# EAGLE design gocupi_v1.1 (EAGLE 6.4)
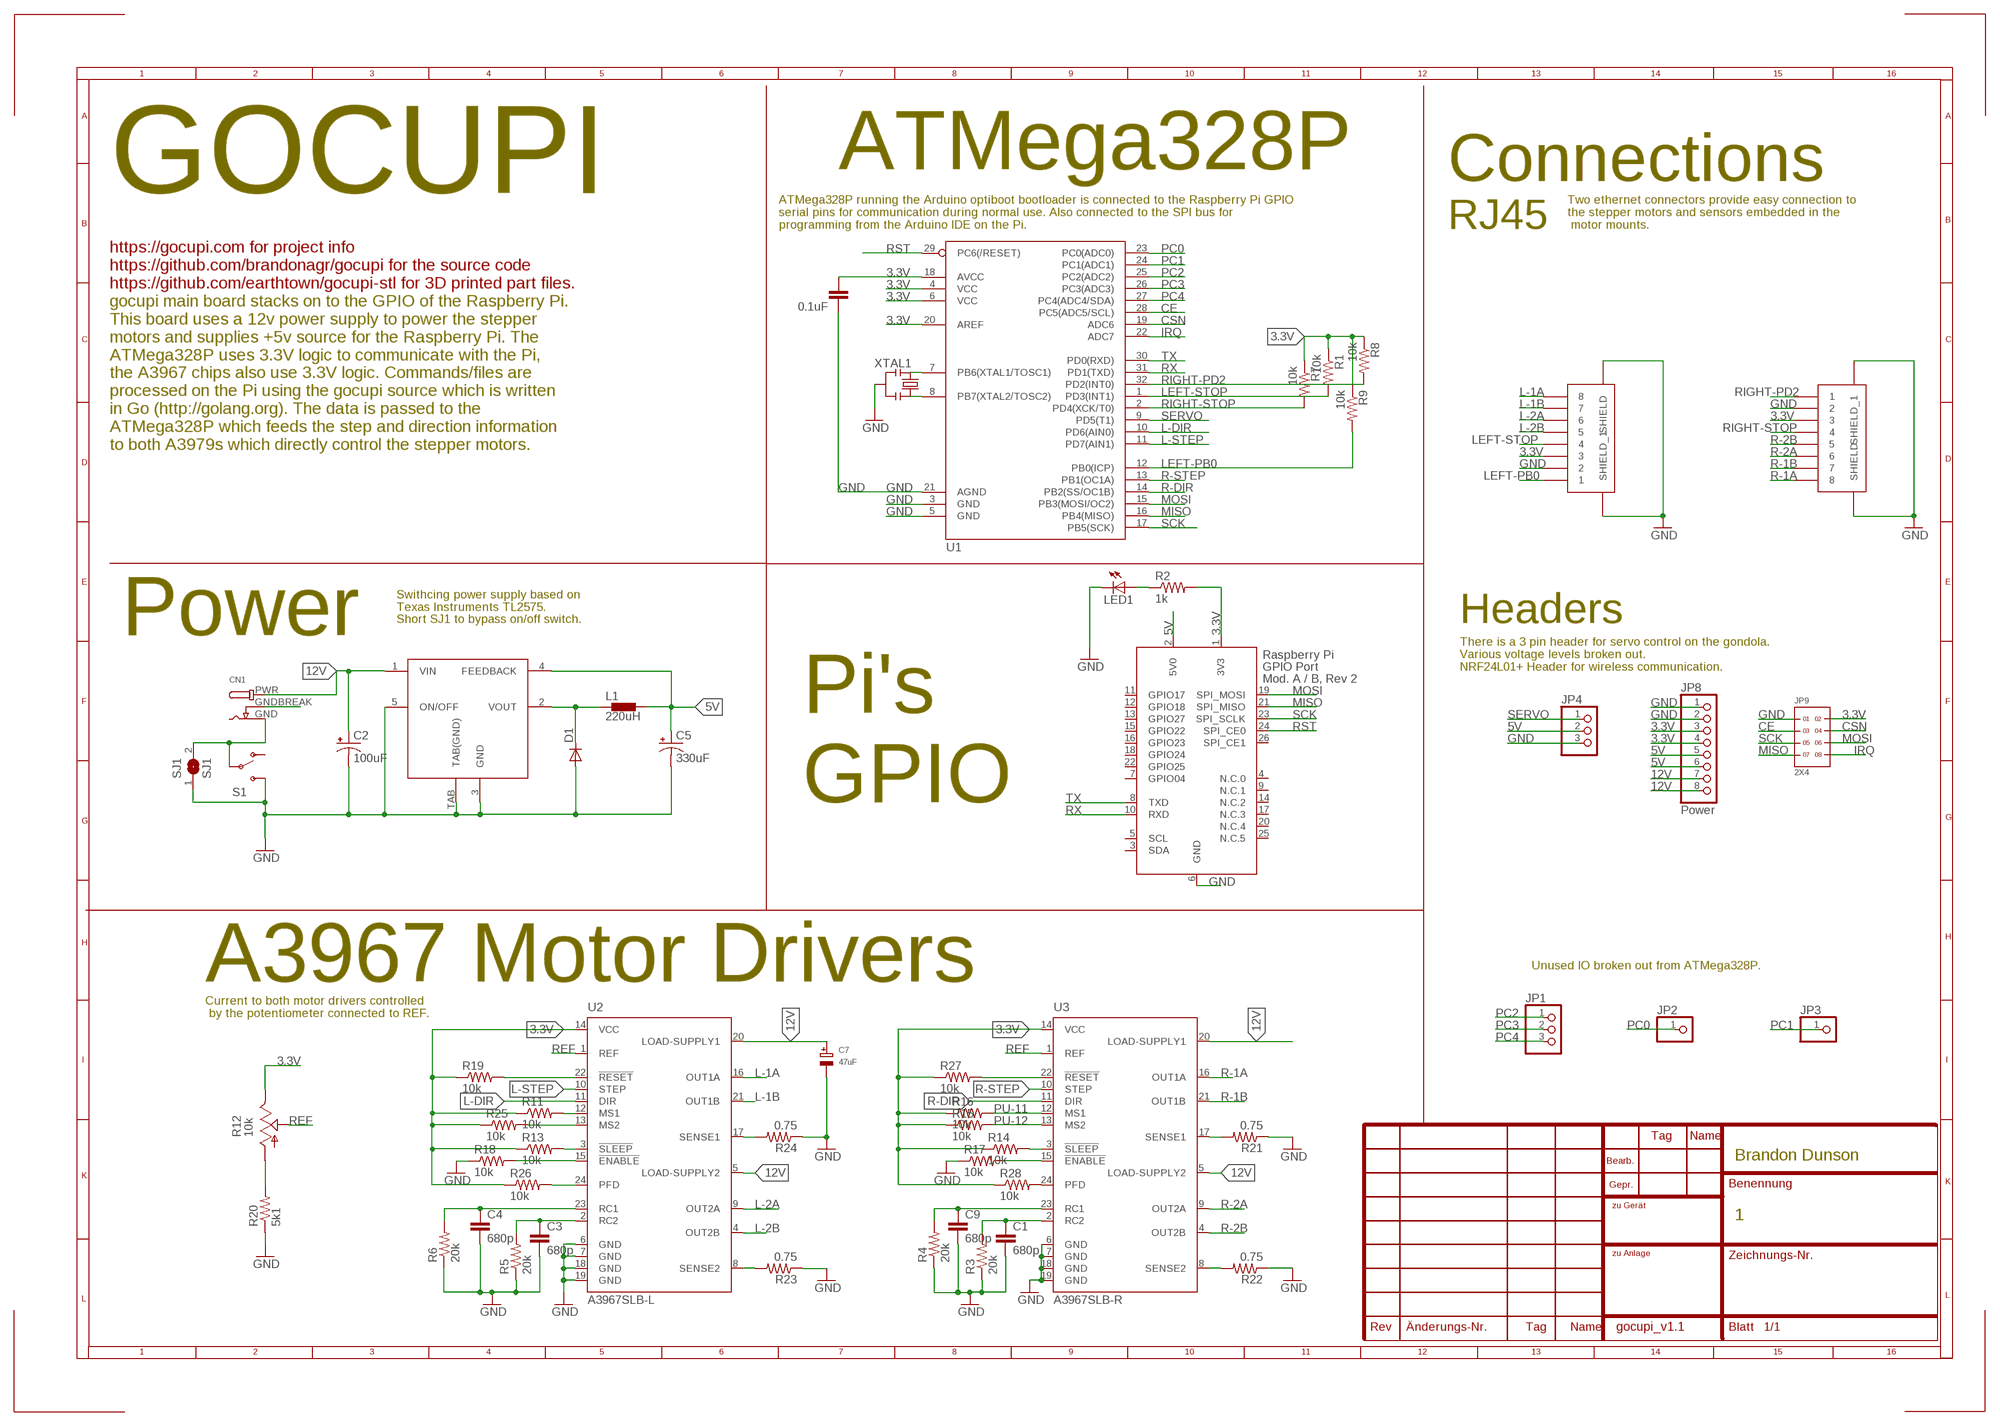
[diagram p0: schematic, sheet 1]

## Parts
C1  680p  CAP0805  [0805]
C2  100uF  CPOL-USD  [PANASONIC_D]
C3  680p  CAP0805  [0805]
C4  680p  CAP0805  [0805]
C5  330uF  CPOL-USF  [PANASONIC_F]
C7  47uF  CAP_ELECTROLYTICPANASONIC_C  [PANASONIC_C]
C8  0.1uF  CAP0805  [0805]
C9  680p  CAP0805  [0805]
CN1  DCBARRELSMT_CORRECT  [DCJACK_2MM_SMT]
D1  DIODE-SOD-123  [SOD-123]
JP1  PINHD-1X3CB  [1X03-CLEANBIG]
JP2  PINHD-1X1CB  [1X01-CLEANBIG]
JP3  PINHD-1X1CB  [1X01-CLEANBIG]
JP4  PINHD-1X3  [1X03]
JP8  Power  PINHD-1X8CLEANBIG  [1X08-CLEANBIG]
JP9  2X4  [2X4]
L1  220uH  SDR1305  [SDR1305]
LED1  LEDCHIPLED_0805  [CHIPLED_0805]
R1  10k  RESISTOR0805-RES  [0805]
R2  1k  RESISTOR0805-RES  [0805]
R3  20k  RESISTOR0805-RES  [0805]
R4  20k  RESISTOR0805-RES  [0805]
R5  20k  RESISTOR0805-RES  [0805]
R6  20k  RESISTOR0805-RES  [0805]
R7  10k  RESISTOR0805-RES  [0805]
R8  10k  RESISTOR0805-RES  [0805]
R9  10k  RESISTOR0805-RES  [0805]
R11  10k  RESISTOR0805-RES  [0805]
R12  10k  TRIM_US-SM-42/43A  [SM-42/43A]
R13  10k  RESISTOR0805-RES  [0805]
R14  10k  RESISTOR0805-RES  [0805]
R15  10k  RESISTOR0805-RES  [0805]
R16  10k  RESISTOR0805-RES  [0805]
R17  10k  RESISTOR0805-RES  [0805]
R18  10k  RESISTOR0805-RES  [0805]
R19  10k  RESISTOR0805-RES  [0805]
R20  5k1  RESISTOR0805-RES  [0805]
R21  0.75  RESISTOR0805-RES  [0805]
R22  0.75  RESISTOR0805-RES  [0805]
R23  0.75  RESISTOR0805-RES  [0805]
R24  0.75  RESISTOR0805-RES  [0805]
R25  10k  RESISTOR0805-RES  [0805]
R26  10k  RESISTOR0805-RES  [0805]
R27  10k  RESISTOR0805-RES  [0805]
R28  10k  RESISTOR0805-RES  [0805]
RJ45-L  RJ45_SMD  [RJ45_SMD]
RJ45-R  RJ45_SMD  [RJ45_SMD]
S1  SWITCH-SPST-SMD-A  [SWITCH-SPST-SMD-A]
SJ1  SJ1  SJ  [SJ]
U1  ATMEGA328_SMT  [TQFP32-08]
U2  A3967SLB-L  A3967SLB  [SO24W]
U3  A3967SLB-R  A3967SLB  [SO24W]
U4  TL2575  [TO263_5]
X1  RASPI_BOARD_AB_E2P  [RASPI_BOARD_AB_EDGES_2DRILL_PAD]
XTAL1  10MHz  RESONATORSMD  [RESONATOR-SMD]

## Nets
3.3V: C8.1 JP8.3 JP8.4 JP9.2 R1.1 R2.2 R7.1 R8.1 R9.1 R11.1 R12.3(E) R13.1 R14.1 R15.1 R16.1 R19.1 R25.1 R26.1 R27.1 R28.1 RJ45-L.P$3 RJ45-R.P$3 U1.4(VCC) U1.6(VCC) U1.18(AVCC) U1.20(AREF) U2.14(VCC) U3.14(VCC) X1.1(3V3)
5V: C5.+ JP4.2 JP8.5 JP8.6 L1.P$2 U4.4(FEEDBACK) X1.2(5V0)
12V: C2.+ C7.+ CN1.PWR JP8.7 JP8.8 U2.5(LOAD-SUPPLY2) U2.20(LOAD-SUPPLY1) U3.5(LOAD-SUPPLY2) U3.20(LOAD-SUPPLY1) U4.1(VIN)
B-GND: CN1.GNDBREAK
CE: JP9.3 U1.28(PC5(ADC5/SCL))
CSN: JP9.4 U1.19(ADC6)
GND: C1.2 C2.- C3.2 C4.2 C5.- C7.- C8.2 C9.2 D1.A JP4.3 JP8.1 JP8.2 JP9.1 LED1.C R3.1 R4.1 R5.1 R6.1 R17.1 R18.1 R20.1 R21.1 R22.1 R23.1 R24.1 RJ45-L.P$2 RJ45-L.P$SHIELD(SHIELD) RJ45-L.P$SHIELD_1(SHIELD_1) RJ45-R.P$2 RJ45-R.P$SHIELD(SHIELD) RJ45-R.P$SHIELD_1(SHIELD_1) S1.3(S) SJ1.1 U1.3(GND) U1.5(GND) U1.21(AGND) U2.6(GND) U2.7(GND) U2.18(GND) U2.19(GND) U3.6(GND) U3.7(GND) U3.18(GND) U3.19(GND) U4.3(GND) U4.5(ON/OFF) U4.TAB(TAB(GND)) X1.6(GND) XTAL1.2
IRQ: JP9.8 U1.22(ADC7)
L-1A: RJ45-L.P$8 U2.16(OUT1A)
L-1B: RJ45-L.P$7 U2.21(OUT1B)
L-2A: RJ45-L.P$6 U2.9(OUT2A)
L-2B: RJ45-L.P$5 U2.4(OUT2B)
L-DIR: U1.10(PD6(AIN0)) U2.11(DIR)
L-STEP: U1.11(PD7(AIN1)) U2.10(STEP)
LEFT-PB0: R9.2 RJ45-L.P$1 U1.12(PB0(ICP))
LEFT-STOP: R1.2 RJ45-L.P$4 U1.1(PD3(INT1))
MISO: JP9.7 U1.16(PB4(MISO)) X1.21(SPI_MISO)
MOSI: JP9.6 U1.15(PB3(MOSI/OC2)) X1.19(SPI_MOSI)
N$1: D1.C L1.P$1 U4.2(VOUT)
N$2: CN1.GND S1.2(P) SJ1.2
N$3: LED1.A R2.1
N$7: R28.2 U3.24(PFD)
N$8: R19.2 U2.22(!RESET)
N$9: R11.2 U2.12(MS1)
N$12: R26.2 U2.24(PFD)
N$15: R27.2 U3.22(!RESET)
N$16: R25.2 U2.13(MS2)
N$17: R17.2 U3.15(!ENABLE)
N$18: R14.2 U3.3(!SLEEP)
N$19: R13.2 U2.3(!SLEEP)
N$21: R12.1(A) R20.2
N$26: R18.2 U2.15(!ENABLE)
N$28: C4.1 R6.2 U2.23(RC1)
N$29: C3.1 R5.2 U2.2(RC2)
N$30: R24.2 U2.17(SENSE1)
N$31: R21.2 U3.17(SENSE1)
N$32: R23.2 U2.8(SENSE2)
N$33: C9.1 R4.2 U3.23(RC1)
N$34: R22.2 U3.8(SENSE2)
N$35: C1.1 R3.2 U3.2(RC2)
N$39: U1.7(PB6(XTAL1/TOSC1)) XTAL1.1
N$40: U1.8(PB7(XTAL2/TOSC2)) XTAL1.3
PC0: JP2.1 U1.23(PC0(ADC0))
PC1: JP3.1 U1.24(PC1(ADC1))
PC2: JP1.1 U1.25(PC2(ADC2))
PC3: JP1.2 U1.26(PC3(ADC3))
PC4: JP1.3 U1.27(PC4(ADC4/SDA))
PU-11: R16.2 U3.12(MS1)
PU-12: R15.2 U3.13(MS2)
R-1A: RJ45-R.P$8 U3.16(OUT1A)
R-1B: RJ45-R.P$7 U3.21(OUT1B)
R-2A: RJ45-R.P$6 U3.9(OUT2A)
R-2B: RJ45-R.P$5 U3.4(OUT2B)
R-DIR: U1.14(PB2(SS/OC1B)) U3.11(DIR)
R-STEP: U1.13(PB1(OC1A)) U3.10(STEP)
REF: R12.2(S) U2.1(REF) U3.1(REF)
RIGHT-PD2: R8.2 RJ45-R.P$1 U1.32(PD2(INT0))
RIGHT-STOP: R7.2 RJ45-R.P$4 U1.2(PD4(XCK/T0))
RST: U1.29(PC6(/RESET)) X1.24(SPI_CE0)
RX: U1.31(PD1(TXD)) X1.10(RXD)
SCK: JP9.5 U1.17(PB5(SCK)) X1.23(SPI_SCLK)
SERVO: JP4.1 U1.9(PD5(T1))
TX: U1.30(PD0(RXD)) X1.8(TXD)
Unconnected: S1.1(O) X1.3(SDA) X1.4(N.C.0) X1.5(SCL) X1.7(GPIO04) X1.9(N.C.1) X1.11(GPIO17) X1.12(GPIO18) X1.13(GPIO27) X1.14(N.C.2) X1.15(GPIO22) X1.16(GPIO23) X1.17(N.C.3) X1.18(GPIO24) X1.20(N.C.4) X1.22(GPIO25) X1.25(N.C.5) X1.26(SPI_CE1)

## Notes on the sheet
- ATMega328P | Connections
- GOCUPI
- ATMega328P running the Arduino optiboot bootloader is connected to the Raspberry Pi GPIO 
  serial pins for communication during normal use. Also connected to the SPI bus for 
  programming from the Arduino IDE on the Pi.
- RJ45
- Two ethernet connectors provide easy connection to
  the stepper motors and sensors embedded in the
   motor mounts.
- gocupi main board stacks on to the GPIO of the Raspberry Pi. 
  This board uses a 12v power supply to power the stepper 
  motors and supplies +5v source for the Raspberry Pi. The
  ATMega328P uses 3.3V logic to communicate with the Pi, 
  the A3967 chips also use 3.3V logic. Commands/files are 
  processed on the Pi using the gocupi source which is written 
  in Go (http://golang.org). The data is passed to the 
  ATMega328P which feeds the step and direction information
  to both A3979s which directly control the stepper motors.
- https://gocupi.com for project info
  https://github.com/brandonagr/gocupi for the source code
  https://github.com/earthtown/gocupi-stl for 3D printed part files.
- Swithcing power supply based on 
  Texas Instruments TL2575.
- Short SJ1 to bypass on/off switch. | Headers
- Power
- There is a 3 pin header for servo control on the gondola.
  Various voltage levels broken out.
  NRF24L01+ Header for wireless communication.
- Pi's
  GPIO
- Unused IO broken out from ATMega328P.
- A3967 Motor Drivers
- Current to both motor drivers controlled
   by the potentiometer connected to REF.
- Brandon Dunson
- 1

## Library data of the parts
C1 C3 C4 C8 C9 = SparkFun-Passives:CAP: Capacitor Standard 0603 ceramic capacitor, and 0.1" leaded capacitor.
C2 C5 = adafruit:CPOL-US: POLARIZED CAPACITOR, American symbol
C7 = microbuilder:CAP_ELECTROLYTIC: Electrolytic Capacitors SMT PANASONIC_C - Size C Panasonic Electrolytic Aluminum Capacitor 47µF 16V 20% Electrolytic Capacitor [Digikey: PCE3890TR-ND] PANASONIC_D - Size D Panasonic Electrolytic Aluminum Capacitor 100µF 25V 20% Electrolytic Capacitor [Digikey: PCE3898TR-ND] PTH 3.5 mm grid, 8 mm diameter ... 3.5 mm grid, 10 mm diameter ...
CN1 = microbuilder:DCBARREL: DC Barrel Jack DCJACK_1.3MM_PTH - Through Hole 1.3mm Jack (4UConnector: 05536) DCJACK_2MM_PTH - Through Hole 2.0/2.1 Jack (4UConnector: 05537) DCJACK_2MM_SMT - SMT 2.0/2.1mm Jack(4UConnector: 03267)
D1 = dp_devices:DIODE: Various Diode Packages
JP1 JP4 = adafruit:PINHD-1X3: PIN HEADER
JP2 JP3 = adafruit:PINHD-1X1: Pin header 1x1 for 0.1" spacing With round pins
JP8 = adafruit:PINHD-1X8: PIN HEADER
JP9 = headers(.1in):2X4
L1 = inductors:SDR1305
LED1 = adafruit:LED: LED OSRAM: - CHIPLED LG R971, LG N971, LY N971, LG Q971, LY Q971, LO R971, LY R971 LH N974, LH R974 LS Q976, LO Q976, LY Q976 LO Q996 - Hyper CHIPLED LW Q18S LB Q993, LB Q99A, LB R99A - SideLED LS A670, LO A670, LY A670, LG A670, LP A670 LB A673, LV A673, LT A673, LW A673 LH A674 LY A675 LS A676, LA A676, LO A676, LY A676, LW A676 LS A679, LY A679, LG A679 - Hyper Micro SIDELED® LS Y876, LA Y876, LO Y876, LY Y876 LT Y87S - SmartLED LW L88C, LW L88S LB L89C, LB L89S, LG L890 LS L89K, LO L89K, LY L89K LS L896, LA L896, LO L896, LY L896 - TOPLED LS T670, LO T670, LY T670, LG T670, LP T670 LSG T670, LSP T670, LSY T670, LOP T670, LYG T670 LG T671, LOG T671, LSG T671 LB T673, LV T673, LT T673, LW T673 LH T674 LS T676, LA T676, LO T676, LY T676, LB T676, LH T676, LSB T676, LW T676 LB T67C, LV T67C, LT T67C, LS T67K, LO T67K, LY T67K, LW E67C LS E67B, LA E67B, LO E67B, LY E67B, LB E67C, LV E67C, LT E67C LW T67C LS T679, LY T679, LG T679 LS T770, LO T770, LY T770, LG T770, LP T770 LB T773, LV T773, LT T773, LW T773 LH T774 LS E675, LA E675, LY E675, LS T675 LS T776, LA T776, LO T776, LY T776, LB T776 LHGB T686 LT T68C, LB T68C - Hyper Mini TOPLED® LB M676 - Mini TOPLED Santana® LG M470 LS M47K, LO M47K, LY M47K Source: http://www.osram.convergy.de/
R1-R9 R11 R13-R24 R26-R28 = SparkFun-Resistors:RESISTOR: Resistor Basic schematic elements and footprints for 0603, 1206, and PTH resistors.
R12 = pot:TRIM_US-: POTENTIOMETER
R25 = SparkFun-Passives:RESISTOR: Resistor Basic schematic elements and footprints for 0603, 1206, and PTH resistors.
RJ45-L RJ45-R = rj45_smd:RJ45_SMD
S1 = SwK-SparkFun:SWITCH-SPST: SPST Switch Simple slide switch. Spark Fun Electronics SKU : COM-00102
SJ1 = jumper:SJ: SMD solder JUMPER
U1 = SparkFun-DigitalIC:ATMEGA328_SMT: 32-Pin Atmega328 part Commonly used on Arduino compatible boards Available in QFP and QFN packages TQFP is IC-09069 QFN is non-stock; PROD_ID: IC-09069; VALUE: ATMEGA328P
U2 U3 = allegro:A3967SLB: MICROSTEPPING DRIVER WITH TRANSLATOR Source: 3967.pdf; MF: ALLEGRO MICROSYSTEMS, INC.; MPN: A3967SLB-T; OC_FARNELL: 1521715; OC_NEWARK: 08J5877
U4 = TL2575_new:TL2575
X1 = raspberrypi_bastelstube_v13:RASPI_BOARD_AB: Raspberry Pi GPIO connector with markings for the outer dimensions of the Raspberry Pi board model A or B with different sets of drill holes or mounting pads for model B Revision 2.0
XTAL1 = SwK-SparkFun:RESONATOR: Resonator Small SMD resonator. This is the itty bitty 10/20MHz resonators with built in caps. CSTCE10M0G55 and CSTCE20M0V53. Footprint has been reviewed closely but hasn't been tested yet.

## Board
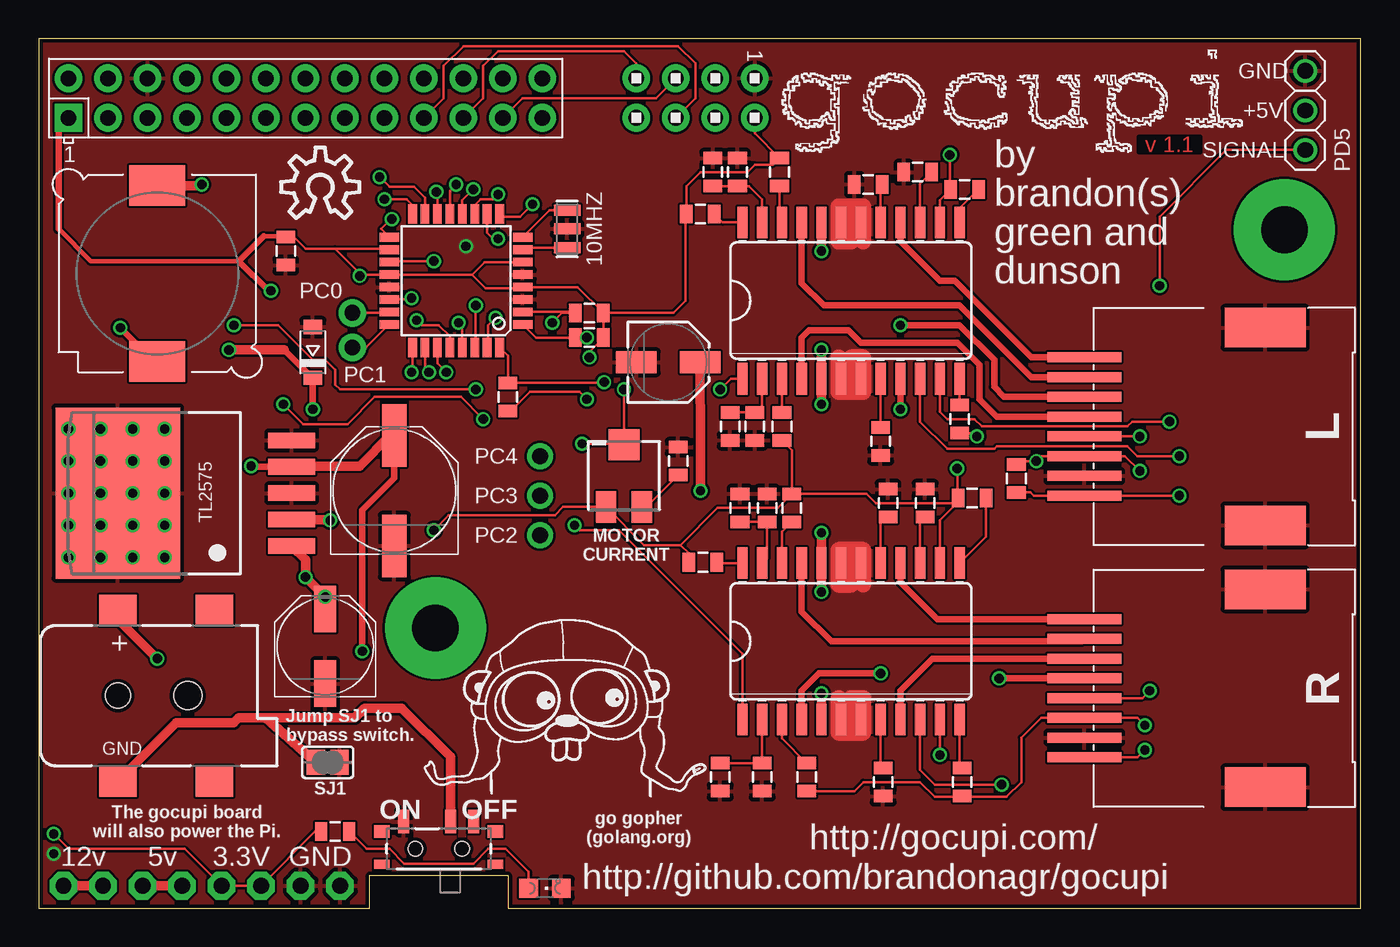
[diagram p1: board, top side]
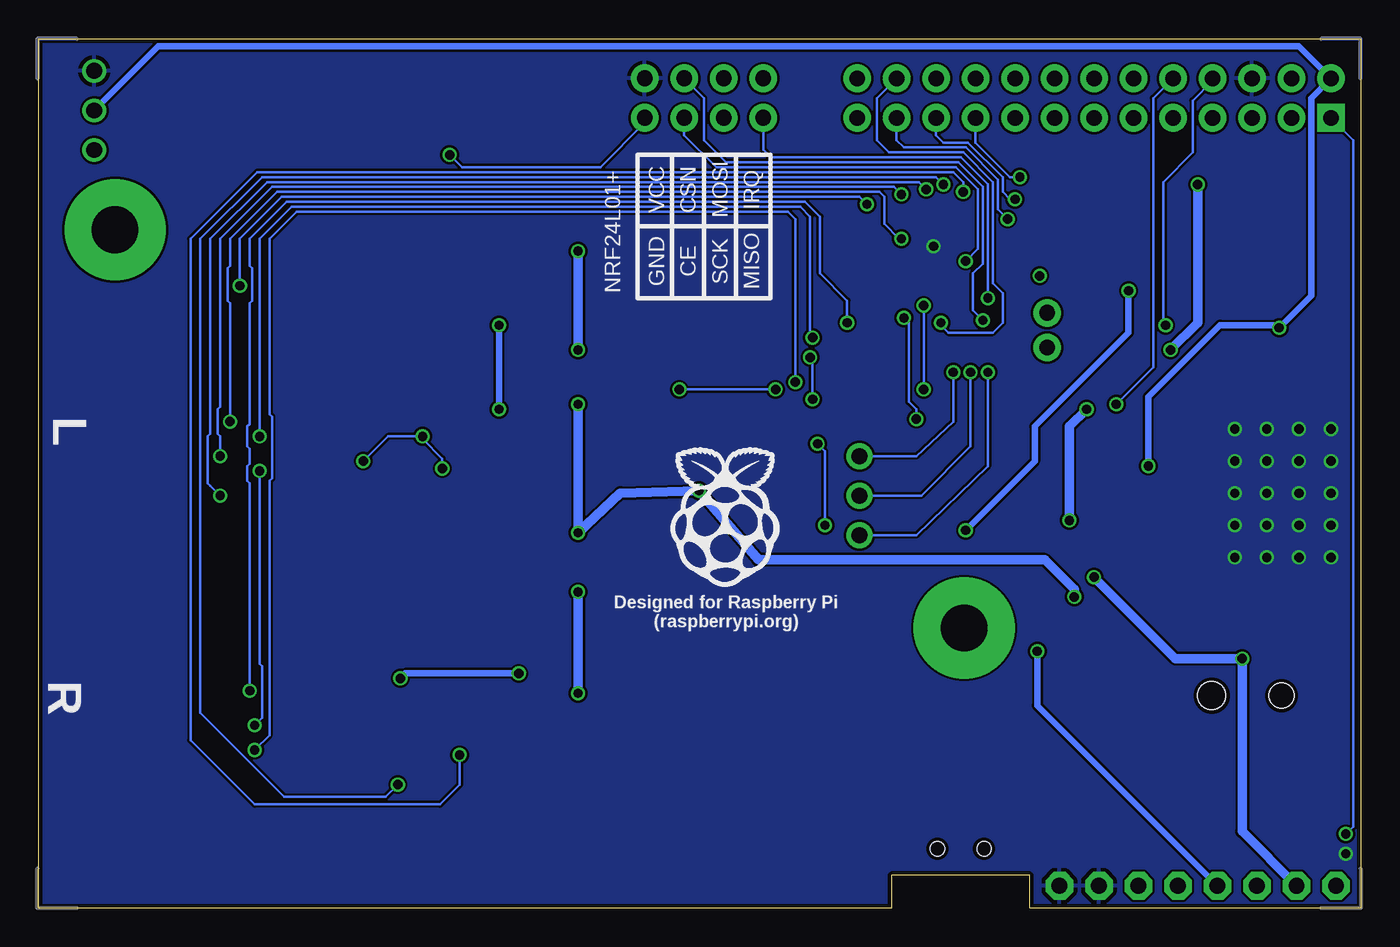
[diagram p2: board, bottom side, seen from below]

Size 85 x 55.87 mm. Coordinates in mm from the lower left corner, seen from the top.
Outline: 0,0 21.27,0 21.27,2.1 30.16,2.1 30.16,0 85,0 85,55.87 0,55.87 0,0
Copper layers (1*2*15*16): Top 0.035mm / dielectric 0.2mm / Route2 0.0175mm / dielectric 1.1mm / Route15 0.0175mm / dielectric 0.2mm / Bottom 0.035mm
Design rules "SeeedStudio_DRU_no_angle_20130527": minimum track width 6mil, minimum drill 12mil, track to track 6mil, track to pad 6mil, pad to pad 6mil, via to via 6mil, smd to smd 0mil, copper to edge 10mil, drill to drill 10mil, minimum pad ring 6mil, minimum via ring 6mil, stop-mask expansion 2mil, vias tented up to drill 25mil, thermal gap 10mil

### Footprints (pad centres in the part's own frame; a part is rotated, then mirrored left to right if it is on the bottom)
0805 = smd 0.8 x 1.2: 1 -0.9,0; 2 0.9,0
PANASONIC_D = smd 3 x 1.4: + 2.4,0; - -2.4,0
PANASONIC_F = smd 4 x 1.6: + 3.55,0; - -3.55,0
PANASONIC_C = smd 2.6 x 1.4: + 2.05,0; - -2.05,0
DCJACK_2MM_SMT = smd 2.4 x 2: GND 0,-5.5; GNDBREAK 6.2,-5.5; PWR 0,5.5; PWR2 6.2,5.5 | hole 1.6: 0,0 | hole 1.8: 4.5,0
SOD-123 = smd 0.91 x 1.22: A 1.635,0; C -1.635,0
1X03-CLEANBIG = drill 1.016 pad 1.676: 1 -2.54,0; 2 0,0; 3 2.54,0
1X01-CLEANBIG = drill 1.016 pad 1.778: 1 0,0
1X03 = drill 1.016: 1 -2.54,0; 2 0,0; 3 2.54,0
1X08-CLEANBIG = drill 1.016 pad 1.778 octagon: 1 -8.89,0; 2 -6.35,0; 3 -3.81,0; 4 -1.27,0; 5 1.27,0; 6 3.81,0; 7 6.35,0; 8 8.89,0
2X4 = drill 1.016 pad 1.778: 1 0,0; 2 0,2.54; 3 2.54,0; 4 2.54,2.54; 5 5.08,0; 6 5.08,2.54; 7 7.62,0; 8 7.62,2.54
SDR1305 = smd 3.6 x 2.6: P$1 0,5.65; P$2 0,-5.65
CHIPLED_0805 = smd 1.2 x 1.2: A 0,-1.05; C 0,1.05
SM-42/43A = smd 2 x 1.3: 1 2,1.15; 3 2,-1.15 | smd 2 x 2: 2 -2,0
RJ45_SMD = smd 0.64 x 4.75: P$1 -4.441,8.969; P$2 -3.171,8.969; P$3 -1.901,8.969; P$4 -0.631,8.969; P$5 0.639,8.969; P$6 1.909,8.969; P$7 3.179,8.969; P$8 4.449,8.969 | smd 2.54 x 5.21: P$SHIELD -6.351,-2.661; P$SHIELD_1 6.349,-2.661
SWITCH-SPST-SMD-A = smd 0.7 x 1.5: 1 -2.25,-1.75; 2 -0.75,-1.75; 3 2.25,-1.75 | smd 1 x 0.6: GND1 -3.65,1; GND3 3.65,1 | smd 1 x 0.8: GND2 -3.65,-1.1; GND4 3.65,-1.1 | hole 0.9: -1.5,0; 1.5,0
SJ = smd 1.168 x 1.6: 1 -0.762,0; 2 0.762,0
TQFP32-08 = smd 1.27 x 0.559: 1 -4.293,2.8; 2 -4.293,2; 3 -4.293,1.2; 4 -4.293,0.4; 5 -4.293,-0.4; 6 -4.293,-1.2; 7 -4.293,-2; 8 -4.293,-2.8; 17 4.293,-2.8; 18 4.293,-2; 19 4.293,-1.2; 20 4.293,-0.4; 21 4.293,0.4; 22 4.293,1.2; 23 4.293,2; 24 4.293,2.8 | smd 0.559 x 1.27: 9 -2.8,-4.293; 10 -2,-4.293; 11 -1.2,-4.293; 12 -0.4,-4.293; 13 0.4,-4.293; 14 1.2,-4.293; 15 2,-4.293; 16 2.8,-4.293; 25 2.8,4.293; 26 2,4.293; 27 1.2,4.293; 28 0.4,4.293; 29 -0.4,4.293; 30 -1.2,4.293; 31 -2,4.293; 32 -2.8,4.293
SO24W = smd 0.66 x 2.032: 1 -6.985,-5.029; 2 -5.715,-5.029; 3 -4.445,-5.029; 4 -3.175,-5.029; 5 -1.905,-5.029; 6 -0.635,-5.029; 7 0.635,-5.029; 8 1.905,-5.029; 9 3.175,-5.029; 10 4.445,-5.029; 11 5.715,-5.029; 12 6.985,-5.029; 13 6.985,5.029; 14 5.715,5.029; 15 4.445,5.029; 16 3.175,5.029; 17 1.905,5.029; 18 0.635,5.029; 19 -0.635,5.029; 20 -1.905,5.029; 21 -3.175,5.029; 22 -4.445,5.029; 23 -5.715,5.029; 24 -6.985,5.029
TO263_5 = smd 1 x 3: 1 -3.4,-8; 2 -1.7,-8; 3 0,-8; 4 1.7,-8; 5 3.4,-8 | smd 11 x 8: TAB 0,3.175
RASPI_BOARD_AB_EDGES_2DRILL_PAD = drill 1 pad 1.778 square: 1 1.905,50.8 | drill 1 pad 1.778: 2 1.905,53.34; 3 4.445,50.8; 4 4.445,53.34; 5 6.985,50.8; 6 6.985,53.34; 7 9.525,50.8; 8 9.525,53.34; 9 12.065,50.8; 10 12.065,53.34; 11 14.605,50.8; 12 14.605,53.34; 13 17.145,50.8; 14 17.145,53.34; 15 19.685,50.8; 16 19.685,53.34; 17 22.225,50.8; 18 22.225,53.34; 19 24.765,50.8; 20 24.765,53.34; 21 27.305,50.8; 22 27.305,53.34; 23 29.845,50.8; 24 29.845,53.34; 25 32.385,50.8; 26 32.385,53.34 | drill 3 pad 6.5: DRILL_1 25.5,18; DRILL_2 80.1,43.6
RESONATOR-SMD = smd 0.7 x 1.7: 1 -1.2,0; 2 0,0; 3 1.2,0

### Placement (x,y rotation side)
C1  46.51,8.41 270 top
C2  18.41,16.83 90 top
C3  44.45,30.96 270 top
C4  43.34,47.31 90 top
C5  22.86,26.83 90 top
C7  40.48,35.08 0 top
C8  15.88,42.23 270 top
C9  45.09,25.72 90 top
CN1  5.08,13.65 0 top
D1  17.62,35.72 90 top
JP1  32.23,26.51 90 top
JP2  20.16,38.26 0 top
JP3  20.16,36.04 0 top
JP4  81.44,51.28 90 top
JP8  10.48,1.43 180 top
JP9  46.04,53.34 180 top
L1  7.62,40.8 0 top
LED1  32.54,1.27 270 top
R1  35.4,36.67 180 top
R2  19.05,4.92 180 top
R3  43.81,8.41 90 top
R4  46.83,25.72 270 top
R5  46.04,30.96 90 top
R6  44.93,47.31 270 top
R7  35.4,38.26 180 top
R8  30.16,32.86 90 top
R9  62.87,27.62 270 top
R11  59.21,31.43 90 top
R12  37.62,27.78 270 top
R13  47.78,30.96 90 top
R14  49.37,8.41 90 top
R15  60.01,26.35 0 top
R16  59.37,8.1 90 top
R17  56.99,26.04 270 top
R18  56.52,47.31 0 top
R19  47.62,47.31 270 top
R20  41.12,28.73 270 top
R21  54.61,26.04 270 top
R22  54.29,8.1 90 top
R23  54.13,30 90 top
R24  53.34,46.51 0 top
R25  59.53,46.2 0 top
R26  42.55,44.61 0 top
R27  48.42,25.72 270 top
R28  42.7,22.23 0 top
RJ45-L  76.2,30.96 90 top
RJ45-R  76.2,14.13 90 top
S1  25.72,3.81 180 top
SJ1  18.57,9.37 180 top
U1  26.83,40.32 180 top
U2  52.23,39.05 0 top
U3  52.23,17.14 0 top
U4  8.26,26.67 90 top
U$1  [OSHWLOGO_TOP_0.2]  18.1,46.35 0 top
U$2  [LETTERS]  47.78,48.58 0 top
U$3  [GO_BLACK]  24.77,7.14 0 top
U$5  [PI_BLACK]  44.45,20.64 0 bottom
X1  0,0 0 top
XTAL1  33.97,43.66 90 top

### Tracks (layer width: path | path; a pad name or v marks a point on that pad's centre or on a via)
3.3V  (via drill 0.6)
  Top 0.154: C8.1 16.4,43.13 17.14,42.39 19.05,42.39 | 19.05,42.39 22.47,42.39 U1.18 | U1.20 20.72,40.72 v20.64,40.64 | U1.20 20.71,40.72 19.05,42.39 | R8.1 30.37,31.96 31.59,33.18 34.77,33.18 v35.24,32.7 | v35.4,35.4 35.4,35.77 R1.1 R7.1 | 11.37,1.81 JP8.4 | JP8.4 JP8.3 17.78,4.92 R2.2 | v0.95,4.76 1.91,3.81 9.37,3.81 JP8.4 | U1.20 27.86,40.72 | 27.86,40.72 28.73,39.85 31.05,39.85 U1.4 34.64,39.92 R7.1 | U1.6 28.66,41.52 27.86,40.72 | R7.1 40.8,38.26 41.59,39.05 41.59,44.56 R26.1 41.65,46.41 42.55,47.31 45.56,47.31 46.04,47.78 47.2,47.78 R19.1 46.04,49.8 JP9.2 | U2.14 57.94,45.51 R25.1 58.58,46.25 v58.58,48.42 | R11.1 60.11,30.53 v60.33,30.32 | R9.1 63.08,28.73 v64.14,28.73 64.45,29.05 RJ45-L.P$3 69.85,29.06 v70.8,28.1 | v59.05,28.26 59.05,26.41 R15.1 | R15.1 59.11,26.09 57.94,24.92 U3.14 | R27.1 53.23,26.62 53.82,26.04 58.79,26.04 R15.1 | 41.27,23.34 43.66,25.72 47.52,25.72 R27.1 | R28.1 41.8,22.81 41.27,23.34 | R27.1 48.42,29.42 R13.1 | v25.4,24.29 26.35,25.24 33.18,25.24 33.72,25.78 R12.3 38.92,23.34 41.27,23.34 | R14.1 52.44,7.51 53.02,8.1 56.67,8.1 57.63,7.14 59.32,7.14 R16.1 59.42,7.14 62.23,7.14 63.18,8.1 63.18,10.95 64.46,12.23 RJ45-R.P$3 70.64,12.23 v71.12,11.75
  Top 0.305: 1.27,43.66 3.33,41.59 12.86,41.59 | 14.45,43.18 15.82,43.18 C8.1
  Top 0.406: 1.27,43.66 1.27,50.16 X1.1 | v14.92,39.69 14.76,39.69 12.86,41.59 14.45,43.18 | v25.4,24.29 25.4,24.13 | 36.35,25.66 R12.3
  Bottom 0.154: v35.24,32.7 35.24,35.24 v35.4,35.4 | X1.1 0.48,49.37 0.48,5.24 v0.95,4.76 | v58.58,48.42 57.78,47.62 48.9,47.62 46.04,50.48 JP9.2 | v64.14,28.73 62.55,30.32 v60.33,30.32 60.33,30.16 59.05,28.89 v59.05,28.26 | v71.12,11.75 70.64,12.22 70.64,15.56 70.8,15.72 v70.8,28.1
  Bottom 0.406: v14.92,39.69 14.92,36.99 20.95,30.96 20.95,28.73 v25.4,24.29
5V  (via drill 0.6)
  Top 0.406: C5.+ 22.86,27.62 20.8,25.56 v20.8,16.51 | v5.24,37.31 7.14,35.4 7.37,35.4 L1.P$2 | U4.4 13.7,28.37 v13.65,28.42
  Top 0.61: C5.+ 22.6,30.38 20.64,28.42 16.3,28.42 U4.4 | JP8.6 JP8.5
  Bottom 0.406: v20.8,16.51 20.8,13.02 JP8.5 | v13.65,28.42 13.65,32.86 9.05,37.47 5.4,37.47 v5.24,37.31 3.17,39.37 3.17,52.07 X1.2 3.97,55.4 77.31,55.4 JP4.2
12V  (via drill 0.6)
  Top 0.61: CN1.PWR 5.08,18.57 v7.62,16.03 | U4.1 17.14,22.38 v17.14,21.27 v18.41,20 C2.+ | v42.55,26.83 42.55,29.67 C7.+ | U2.20 v50.32,42.23 | v50.32,35.88 U2.5 v50.32,32.38 | v50.32,24.13 U3.20 v50.32,20.32 | v50.32,13.81 U3.5 | JP8.8 JP8.7
  Bottom 0.61: v17.14,21.27 11.91,16.03 v7.62,16.03 7.62,4.92 JP8.7 | v18.41,20 18.41,20.48 20.32,22.38 38.73,22.38 v42.55,26.83 47.62,26.67 v50.32,24.13 v50.32,32.38 | v50.32,42.23 v50.32,35.88 | v50.32,20.32 v50.32,13.81
CE  (via drill 0.6)
  Top 0.154: U1.28 26.43,36.75 25.72,37.47 24.61,37.47 v24.29,37.78
  Bottom 0.154: v24.29,37.78 24.92,38.42 24.92,40.8 24.29,41.43 24.29,46.35 25.88,47.94 40.8,47.94 42.23,49.37 42.23,52.07 JP9.3
CSN  (via drill 0.6)
  Top 0.154: v25.4,41.59 22.61,41.59 U1.19
  Bottom 0.154: v25.4,41.59 24.61,42.39 24.61,46.2 26.04,47.62 41.43,47.62 43.5,49.69 JP9.4
GND  (via drill 0.6)
  Top 1.016: 53.02,42.86 53.02,45.09 51.44,45.09 51.44,42.86 52.23,42.86 52.23,44.72 | 53.02,20.8 53.02,23.02 51.44,23.02 51.44,20.8 52.23,20.8 52.23,22.7 | 51.44,13.49 51.44,11.27 53.02,11.27 53.02,13.49 52.23,13.49 52.23,11.59 | 51.44,35.4 51.44,33.18 53.02,33.18 53.02,35.4 52.23,35.4 52.23,33.5 | 52.23,44.77 52.23,44.72 | 52.23,44.72 U2.18
  other vias: 1.91,30.8 3.97,30.8 6.03,30.8 8.1,30.8 1.91,28.73 3.97,28.73 6.03,28.73 8.1,28.73 1.91,26.67 3.97,26.67 6.03,26.67 8.1,26.67 1.91,24.61 3.97,24.61 6.03,24.61 8.1,24.61 1.91,22.54 3.97,22.54 6.03,22.54 8.1,22.54 0.95,3.49 27.46,42.55
  pour Top: 0,0 21.27,0 21.27,2.06 30.16,2.06 30.16,0 84.93,0 84.93,55.88 0,55.88
  pour Bottom: 0,0 84.93,0 84.93,55.88 0,55.88
IRQ  (via drill 0.6)
  Top 0.154: U1.22 24.2,39.12 v23.97,39.21
  Bottom 0.154: v23.97,39.21 23.97,46.51 25.72,48.26 37.94,48.26 38.42,48.74 JP9.8
L-1A
  Top 0.406: U2.16 55.4,42.86 57.94,40.32 58.9,40.32 63.81,35.41 RJ45-L.P$8
L-1B
  Top 0.406: U2.21 49.05,40.16 50.48,38.73 59.21,38.73 63.82,34.13 RJ45-L.P$7
L-2A  (via drill 0.6)
  Top 0.406: U2.9 v55.4,32.07 | v55.4,37.47 59.21,37.47 61.44,35.24 61.44,33.5 62.07,32.86 RJ45-L.P$6
  Bottom 0.406: v55.4,32.07 v55.4,37.47
L-2B
  Top 0.406: RJ45-L.P$5 61.59,31.59 60.48,32.7 60.48,34.92 59.05,36.35 52.86,36.35 52.07,37.15 49.53,37.15 49.05,36.67 U2.4
L-DIR  (via drill 0.6)
  Top 0.154: U2.11 57.94,31.91 58.42,31.43 60.17,31.43 60.64,30.96 70.01,30.96 70.33,31.27 v72.71,31.27 | U1.10 28.83,43.4 29.21,43.02 v29.53,43.02
  Bottom 0.154: v72.71,31.27 72.71,38.89 72.87,39.05 72.87,41.12 72.71,41.27 72.71,43.02 69.69,46.04 30.96,46.04 30.64,45.72 30.64,43.97 29.69,43.02 v29.53,43.02
L-STEP  (via drill 0.6)
  Top 0.154: U2.10 56.67,31.27 58.42,29.53 61.44,29.53 61.59,29.69 70.01,29.69 70.64,29.05 v73.34,29.05 | U1.11 28.03,45.17 28.42,45.56 29.21,45.56 v29.53,45.88
  Bottom 0.154: v29.53,45.88 30,46.35 70.01,46.35 73.34,43.02 73.34,32.23 73.5,32.07 73.5,30.48 73.34,30.32 v73.34,29.05
LEFT-PB0  (via drill 0.6)
  Top 0.154: U1.12 27.23,45.48 v27.94,46.2 | v73.34,26.51 v73.34,26.52 RJ45-L.P$1 63.98,26.51 63.77,26.72 R9.2
  Bottom 0.154: v27.94,46.2 28.42,46.67 70.33,46.67 73.98,43.02 73.98,30.48 74.14,30.32 74.14,27.3 73.98,27.15 v73.34,26.51
LEFT-STOP  (via drill 0.6)
  Top 0.154: U1.1 31.97,36.67 R1.2 v35.24,36.67 | RJ45-L.P$4 v70.8,30.32
  Bottom 0.154: v35.24,36.67 35.4,36.83 35.4,44.45 36.04,45.09 68.74,45.09 70.8,43.02 v70.8,30.32
MISO  (via drill 0.6)
  Top 0.154: U1.16 24.03,45.19 23.65,45.56 v22.23,45.56 | X1.21 28.57,52.07 28.57,54.13 29.53,55.09 37.62,55.09 38.42,54.29 JP9.7
  Bottom 0.154: v22.23,45.56 22.54,45.56 23.02,46.04 23.02,46.99 25.24,49.21 26.83,49.21 27.3,49.69 X1.21
MOSI  (via drill 0.6)
  Top 0.154: U1.15 24.83,45.66 24.13,46.35 22.54,46.35 v21.91,46.99 | X1.19 26.04,52.07 26.04,54.13 27.3,55.4 41.12,55.4 42.23,54.29 42.23,52.07 JP9.6
  Bottom 0.154: v21.91,46.99 22.54,46.99 24.77,49.21 X1.19
N$1  (via drill 0.6)
  Top 0.406: 15.79,35.88 17.58,34.08 D1.C v17.62,32.07
  Top 0.61: U4.2 18.69,24.97 v18.73,24.92 | L1.P$1 10.41,46.45 v10.48,46.51 | v12.22,35.88 15.79,35.88
  Bottom 0.61: v18.73,24.92 18.73,30.96 v17.62,32.07 | v10.48,46.51 10.48,37.62 v12.22,35.88
N$2
  Top 0.61: CN1.GND 8.83,11.91 12.54,11.91 12.86,12.22 14.57,12.22 | 14.57,12.22 20.32,12.22 20.95,12.86 23.34,12.86 26.47,9.73 S1.2 | SJ1.2 14.57,12.22
N$3
  Top 0.154: R2.1 21.06,3.81 22.54,3.81 23.5,2.86 27.94,2.86 28.89,3.81 30,3.81 31.49,2.32 LED1.A
N$7
  Top 0.154: U3.24 43.66,22.17 R28.2
N$8
  Top 0.154: R19.2 47.62,44.24 U2.22
N$9
  Top 0.154: U2.12 R11.2
N$12
  Top 0.154: U2.24 43.97,44.08 R26.2
N$15
  Top 0.154: U3.22 47.78,24.18 R27.2
N$16
  Top 0.154: U2.13 59.21,44.98 R25.2
N$17
  Top 0.154: R17.2 56.99,25.08 56.67,24.77 U3.15
N$18
  Top 0.154: U3.3 47.78,10.9 R14.2
N$19
  Top 0.154: R13.2 U2.3
N$21
  Top 0.154: R12.1 39.06,25.78 R20.2
N$26
  Top 0.154: U2.15 56.67,46.57 R18.2
N$28
  Top 0.154: C4.1 R6.2 45.67,46.41 46.51,45.56 U2.23
N$29
  Top 0.154: U2.2 46.51,32.33 R5.2 C3.1
N$30
  Top 0.154: U2.17 54.13,46.41 R24.2
N$31
  Top 0.154: R21.2 54.5,25.14 54.13,24.77 U3.17
N$32
  Top 0.154: U2.8 R23.2
N$33
  Top 0.154: C9.1 R4.2 46.83,22.49 U3.23
N$34
  Top 0.154: U3.8 54.13,9.15 R22.2
N$35
  Top 0.154: U3.2 C1.1 R3.2
N$39
  Top 0.154: XTAL1.1 31.25,42.46 U1.7
N$40
  Top 0.154: XTAL1.3 32.85,44.86 U1.8
PC0
  Top 0.154: JP2.1 22.47,38.26 U1.23
PC1
  Top 0.154: JP3.1 21.05,36.04 U1.24
PC2  (via drill 0.6)
  Top 0.154: U1.25 24.03,34.51 v23.97,34.45
  Bottom 0.154: v23.97,34.45 23.97,28.42 28.57,23.97 JP1.1
PC3  (via drill 0.6)
  Top 0.154: U1.26 24.83,34.7 v25.08,34.45
  Bottom 0.154: v25.08,34.45 25.08,29.69 28.26,26.51 JP1.2
PC4  (via drill 0.6)
  Top 0.154: U1.27 25.63,35.01 v26.19,34.45
  Bottom 0.154: v26.19,34.45 26.19,31.27 28.57,29.05 JP1.3
PU-11
  Top 0.154: U3.12 59.21,9.15 R16.2
PU-12
  Top 0.154: R15.2 60.91,23.87 U3.13
R-1A
  Top 0.406: U3.16 55.4,20.95 57.78,18.57 RJ45-R.P$8
R-1B
  Top 0.406: U3.21 49.05,19.05 50.96,17.14 67.07,17.14 RJ45-R.P$7
R-2A
  Top 0.406: U3.9 55.4,13.97 57.47,16.03 RJ45-R.P$6
R-2B  (via drill 0.6)
  Top 0.406: U3.4 49.05,13.97 50.16,15.08 v54.13,15.08 | v61.75,14.76 RJ45-R.P$5
  Bottom 0.406: v54.13,15.08 61.44,15.08 v61.75,14.76
R-DIR  (via drill 0.6)
  Top 0.154: U1.14 25.63,45.97 v25.56,46.04 | U3.11 v57.94,9.84
  Bottom 0.154: v25.56,46.04 25.56,46.67 26.19,47.31 70.96,47.31 75.25,43.02 75.25,10.79 71.12,6.67 59.21,6.67 57.94,7.94 v57.94,9.84
R-STEP  (via drill 0.6)
  Top 0.154: U1.13 26.43,46.11 v26.83,46.51 | v61.91,7.94 57.63,7.94 56.67,8.89 U3.10
  Bottom 0.154: v26.83,46.51 27.3,46.99 70.64,46.99 74.61,43.02 74.61,12.54 69.22,7.14 62.71,7.14 v61.91,7.94
REF  (via drill 0.6)
  Top 0.154: U2.1 44.5,34.02 v43.81,33.34 | v37.62,33.34 R12.2 37.56,29.84 v34.92,29.84 | U3.1 45.24,16.35 37.31,24.29 34.77,24.29 v34.45,24.61
  Bottom 0.154: v43.81,33.34 v37.62,33.34 | v34.45,24.61 34.45,29.37 v34.92,29.84
RIGHT-PD2  (via drill 0.6)
  Top 0.154: U1.32 30.16,35.5 R8.2 36.3,33.76 v36.35,33.81 | RJ45-R.P$1 70.65,9.69 v71.12,10.16
  Bottom 0.154: v36.35,33.81 36.35,44.29 36.83,44.77 68.42,44.77 70.17,43.02 70.17,31.75 70.01,31.59 70.01,27.62 70.17,27.46 70.17,11.11 v71.12,10.16
RIGHT-STOP  (via drill 0.6)
  Top 0.154: U1.2 34.44,38.32 R7.2 33.66,38.26 v33.02,37.62 | RJ45-R.P$4 70.96,13.49 v71.44,13.97
  Bottom 0.154: v33.02,37.62 33.02,39.05 34.77,40.8 34.77,44.45 35.72,45.4 69.06,45.4 71.44,43.02 71.44,41.27 71.28,41.12 71.28,39.05 71.44,38.89 71.44,31.11 71.6,30.96 71.6,29.69 71.44,29.53 71.44,28.57 71.6,28.42 71.6,27.46 71.44,27.3 v71.44,13.97
RST  (via drill 0.6)
  Top 0.154: U1.29 27.23,37.38 v26.99,37.62
  Bottom 0.154: v26.99,37.62 26.99,37.47 26.51,36.99 23.65,36.99 23.02,37.62 23.02,39.53 23.65,40.16 23.65,46.67 25.56,48.58 30.32,48.58 31.11,49.37 31.11,52.07 X1.24
RX  (via drill 0.6)
  Top 0.154: v15.72,32.38 16.99,31.11 19.84,31.11 21.59,32.86 27.15,32.86 v28.57,31.43 | v29.37,37.94 28.89,37.47 28.89,36.09 U1.31
  Bottom 0.154: v28.57,31.43 28.57,32.07 29.05,32.54 29.05,37.62 v29.37,37.94 | X1.10 13.34,52.07 13.34,34.77 v15.72,32.38
SCK  (via drill 0.6)
  Top 0.154: U1.17 22,43.66 22.64,44.29 v22.7,44.29 | X1.23 31.11,52.07 39.69,52.07 JP9.5
  Bottom 0.154: X1.23 29.84,49.37 29.37,48.9 25.4,48.9 23.34,46.83 23.34,44.93 v22.7,44.29
SERVO  (via drill 0.6)
  Top 0.154: U1.9 29.79,44.45 30.96,44.45 v31.75,45.24 | v72.07,40.01 72.07,44.45 76.36,48.74 JP4.1
  Bottom 0.154: v31.75,45.24 32.23,45.72 69.37,45.72 72.07,43.02 v72.07,40.01
TX  (via drill 0.6)
  Top 0.154: v12.54,37.47 15.4,37.47 17.62,35.24 18.41,35.24 19.05,34.61 19.05,33.66 19.37,33.34 v28.1,33.34 | v28.1,38.73 28.1,36.1 U1.30
  Bottom 0.154: v28.1,33.34 v28.1,38.73 | X1.8 9.53,53.18 10.79,51.91 10.79,48.58 12.7,46.67 12.7,37.78 12.54,37.62 v12.54,37.47

### Text on the board
Top: v 1.1
tPlace: 1 | GND | +5V | SIGNAL | PD5 | 10MHZ | by / brandon(s) / green and / dunson | PC0 | PC1 | L | PC4 | PC3 | PC2 | MOTOR / CURRENT | R | Jump SJ1 to / bypass switch. | The gocupi board / will also power the Pi. | ON OFF | go gopher / (golang.org) | http://gocupi.com/ | 12v | 5v | 3.3V | GND | http://github.com/brandonagr/gocupi
bPlace: VCC / CSN / MOSI / IRQ | GND / CE / SCK / MISO | NRF24L01+ | L | Designed for Raspberry Pi / (raspberrypi.org) | R
tValues: PC0 | PC1 | PC4 | PC3 | PC2